# Altium schematic sheet Motor.SchDoc
size A3
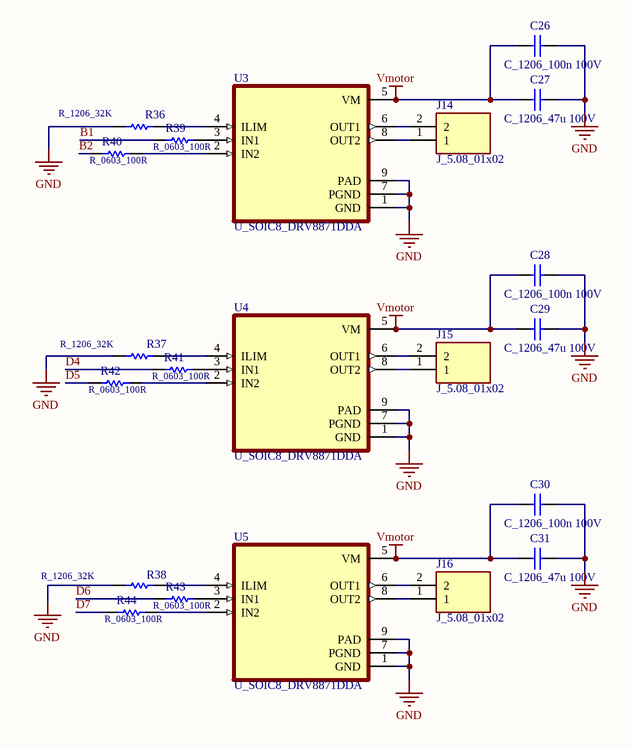
[diagram p0: Motor.SchDoc]

## Parts
C26  C_1206_100n 100V  [CAP 1206]
C27  C_1206_47u 100V  [CAP 1206]
C28  C_1206_100n 100V  [CAP 1206]
C29  C_1206_47u 100V  [CAP 1206]
C30  C_1206_100n 100V  [CAP 1206]
C31  C_1206_47u 100V  [CAP 1206]
J14  J_5.08_01x02  [2 Pin PCB STB 5.08]
J15  J_5.08_01x02  [2 Pin PCB STB 5.08]
J16  J_5.08_01x02  [2 Pin PCB STB 5.08]
R36  R_1206_32K  [RES 1206]
R37  R_1206_32K  [RES 1206]
R38  R_1206_32K  [RES 1206]
R39  R_0603_100R  [RES 1206]
R40  R_0603_100R  [RES 1206]
R41  R_0603_100R  [RES 1206]
R42  R_0603_100R  [RES 1206]
R43  R_0603_100R  [RES 1206]
R44  R_0603_100R  [RES 1206]
U3  U_SOIC8_DRV8871DDA  [SOIC8]
U4  U_SOIC8_DRV8871DDA  [SOIC8]
U5  U_SOIC8_DRV8871DDA  [SOIC8]

## Nets
GND: C26.2 C27.2 C28.2 C29.2 C30.2 C31.2 R36.1 R37.1 R38.1 U3.1(GND) U3.7(PGND) U3.9(PAD) U4.1(GND) U4.7(PGND) U4.9(PAD) U5.1(GND) U5.7(PGND) U5.9(PAD)
Vmotor: C26.1 C27.1 C28.1 C29.1 C30.1 C31.1 U3.5(VM) U4.5(VM) U5.5(VM)
B1: R39.1
B2: R40.1
D4: R41.1
D5: R42.1
D6: R43.1
D7: R44.1
NetJ14_1: J14.1 U3.8(OUT2)
NetJ14_2: J14.2 U3.6(OUT1)
NetJ15_1: J15.1 U4.8(OUT2)
NetJ15_2: J15.2 U4.6(OUT1)
NetJ16_1: J16.1 U5.8(OUT2)
NetJ16_2: J16.2 U5.6(OUT1)
NetR36_2: R36.2 U3.4(ILIM)
NetR37_2: R37.2 U4.4(ILIM)
NetR38_2: R38.2 U5.4(ILIM)
NetR39_2: R39.2 U3.3(IN1)
NetR40_2: R40.2 U3.2(IN2)
NetR41_2: R41.2 U4.3(IN1)
NetR42_2: R42.2 U4.2(IN2)
NetR43_2: R43.2 U5.3(IN1)
NetR44_2: R44.2 U5.2(IN2)

## Library data of the parts
C26-C31 = Cap: Capacitor; Published: 8-Jun-2000; LatestRevisionDate: 17-Jul-2002; LatestRevisionNote: Re-released for DXP Platform.; Publisher: Altium Limited
J14-J16 = 2 Pin PCB Terminal Block: MF: CUI Devices; MP: TBP02R1-381-02BE; CUI_purchase_URL: https://www.cuidevices.com/product/interconnect/connectors/terminal-blocks/tbp02r1-381-series?utm_source=snapeda.com&utm_medium=referral&utm_campaign=snapedaBOM; Purchase-URL: https://pricing.snapeda.com/search/part/TBP02R1-381-02BE/?ref=eda; Price: None; SnapEDA_Link: https://www.snapeda.com/parts/TBP02R1-381-02BE/CUI+Devices/view-part/?ref=snap; Check_prices: https://www.snapeda.com/parts/TBP02R1-381-02BE/CUI+Devices/view-part/?ref=eda; Package: None; Availability: In Stock; Value: *
R36-R44 = Res: Resistor; Published: 8-Jun-2000; LatestRevisionDate: 17-Jul-2002; LatestRevisionNote: Re-released for DXP Platform.; Publisher: Altium Limited
U3-U5 = DRV8871DDA: 45-V, 3.6-A H-bridge motor driver with integrated current sensing 8-SO PowerPAD -40 to 125; MF: Texas Instruments; Mouser-Purchase-URL: https://snapeda.com/shop?store=Mouser&id=547750; SnapEDA_Link: https://www.snapeda.com/parts/DRV8871DDA/Texas%20Instruments/view-part/547750/?ref=snap; DigiKey-Purchase-URL: https://snapeda.com/shop?store=DigiKey&id=547750; Arrow_Electronics-Purchase-URL: https://snapeda.com/shop?store=Arrow+Electronics&id=547750; MP: DRV8871DDA; Texas_Instruments-Purchase-URL: https://snapeda.com/shop?store=Texas+Instruments&id=547750; Availability: Good; Price: None; Value: *; Package: HSOIC-8 Texas Instruments; BuyPart: https://www.snapeda.com/parts/DRV8871DDA/Texas%20Instruments/view-part/547750/?ref=eda